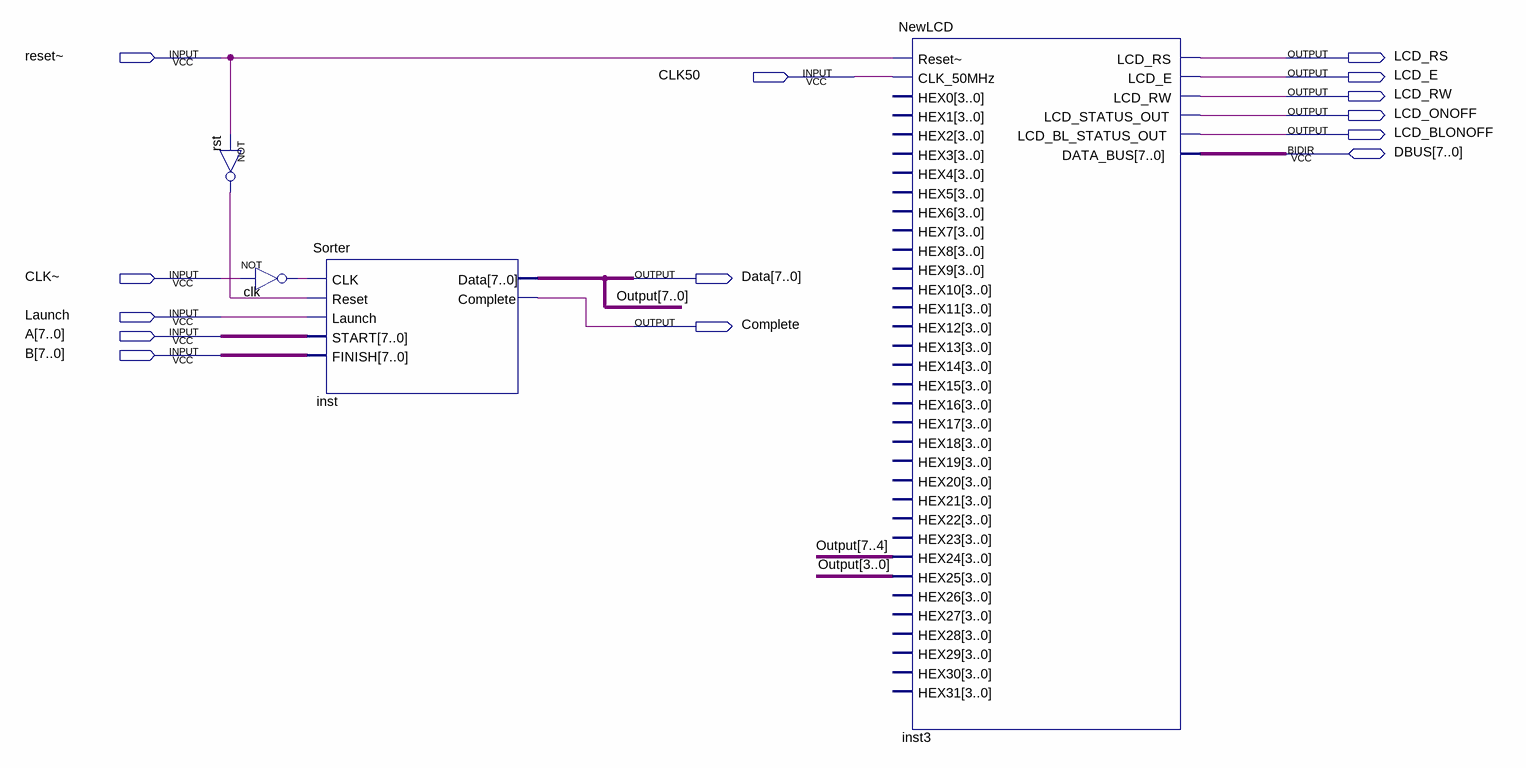
[diagram p0: schematic sheet]
// Quartus schematic Sorterbdf.bdf as structural Verilog: 4 symbols, 14 pins
module Sorterbdf (
  input  \reset~ ,
  input  CLK50,
  input  \CLK~ ,
  input  Launch,
  input  [7:0] A,
  input  [7:0] B,
  inout  [7:0] DBUS,
  output LCD_RS,
  output LCD_E,
  output LCD_RW,
  output LCD_ONOFF,
  output LCD_BLONOFF,
  output [7:0] Data,
  output Complete
);

  wire clk_out, rst_out;

  not rst (rst_out, \reset~ );
  not clk (clk_out, \CLK~ );
  Sorter inst (
    .CLK(clk_out), .Reset(rst_out), .Launch(Launch), .START(A), .FINISH(B), .Data(Data), .Complete(Complete));
  NewLCD inst3 (
    .\Reset~ (\reset~ ), .CLK_50MHz(CLK50), .HEX24(Data[7:4]), .HEX25(Data[3:0]), .LCD_RS(LCD_RS),
    .LCD_E(LCD_E), .LCD_RW(LCD_RW), .LCD_STATUS_OUT(LCD_ONOFF), .LCD_BL_STATUS_OUT(LCD_BLONOFF),
    .DATA_BUS(DBUS));  // open: HEX0, HEX1, HEX2, HEX3, HEX4, HEX5, HEX6, HEX7, HEX8, HEX9, HEX10, HEX11, HEX12, HEX13, HEX14, HEX15, HEX16, HEX17, HEX18, HEX19, HEX20, HEX21, HEX22, HEX23, HEX26, HEX27, HEX28, HEX29, HEX30, HEX31

  // Other names for the same wires on the sheet: Output[7:0] = Data
endmodule
